# EAGLE design 7seg (EAGLE 6.4)
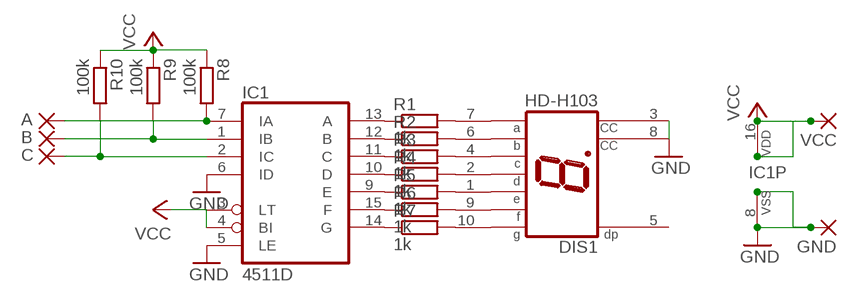
[diagram p0: schematic, sheet 1]

## Parts
A  1,6/0,9  [1,6/0,9]
B  1,6/0,9  [1,6/0,9]
C  1,6/0,9  [1,6/0,9]
DIS1  HD-H103  [HDSP-M]
GND  1,6/0,9  [1,6/0,9]
IC1  4511D  [SO16]
R1  1k  R-EU_R0805  [R0805]
R2  1k  R-EU_R0805  [R0805]
R3  1k  R-EU_R0805  [R0805]
R4  1k  R-EU_R0805  [R0805]
R5  1k  R-EU_R0805  [R0805]
R6  1k  R-EU_R0805  [R0805]
R7  1k  R-EU_R0805  [R0805]
R8  100k  R-EU_R0805  [R0805]
R9  100k  R-EU_R0805  [R0805]
R10  100k  R-EU_R0805  [R0805]
VCC  1,6/0,9  [1,6/0,9]

## Nets
GND: DIS1.3(CC) DIS1.8(CC) IC1.5(LE) IC1.6(ID) IC1.8(VSS)
N$1: IC1.13(A) R1.1
N$2: DIS1.7(A) R1.2
N$3: IC1.12(B) R2.1
N$4: DIS1.6(B) R2.2
N$5: IC1.11(C) R3.1
N$6: DIS1.4(C) R3.2
N$7: IC1.10(D) R4.1
N$8: DIS1.2(D) R4.2
N$9: IC1.9(E) R5.1
N$10: DIS1.1(E) R5.2
N$11: IC1.15(F) R6.1
N$12: DIS1.9(F) R6.2
N$13: IC1.14(G) R7.1
N$14: DIS1.10(G) R7.2
N$15: A.1(P) IC1.7(IA) R8.2
N$16: B.1(P) IC1.1(IB) R9.2
N$17: C.1(P) IC1.2(IC) R10.2
N$18: GND.1(P)
N$19: VCC.1(P)
VCC: IC1.3(LT) IC1.4(BI) IC1.16(VDD) R8.1 R9.1 R10.1
Unconnected: DIS1.5(DP)

## Library data of the parts
A B C GND VCC = wirepad:1,6/0,9: THROUGH-HOLE PAD
DIS1 = display-hp:HD-H103: LED DISPLAY 1-character 7 segment, decimal point right; OC_FARNELL: unknown; OC_NEWARK: unknown
IC1 = 45xx:4511: BCD to 7-segment LATCH/DECODER/DRIVER
R1-R10 = rcl:R-EU_: RESISTOR, European symbol

## Board
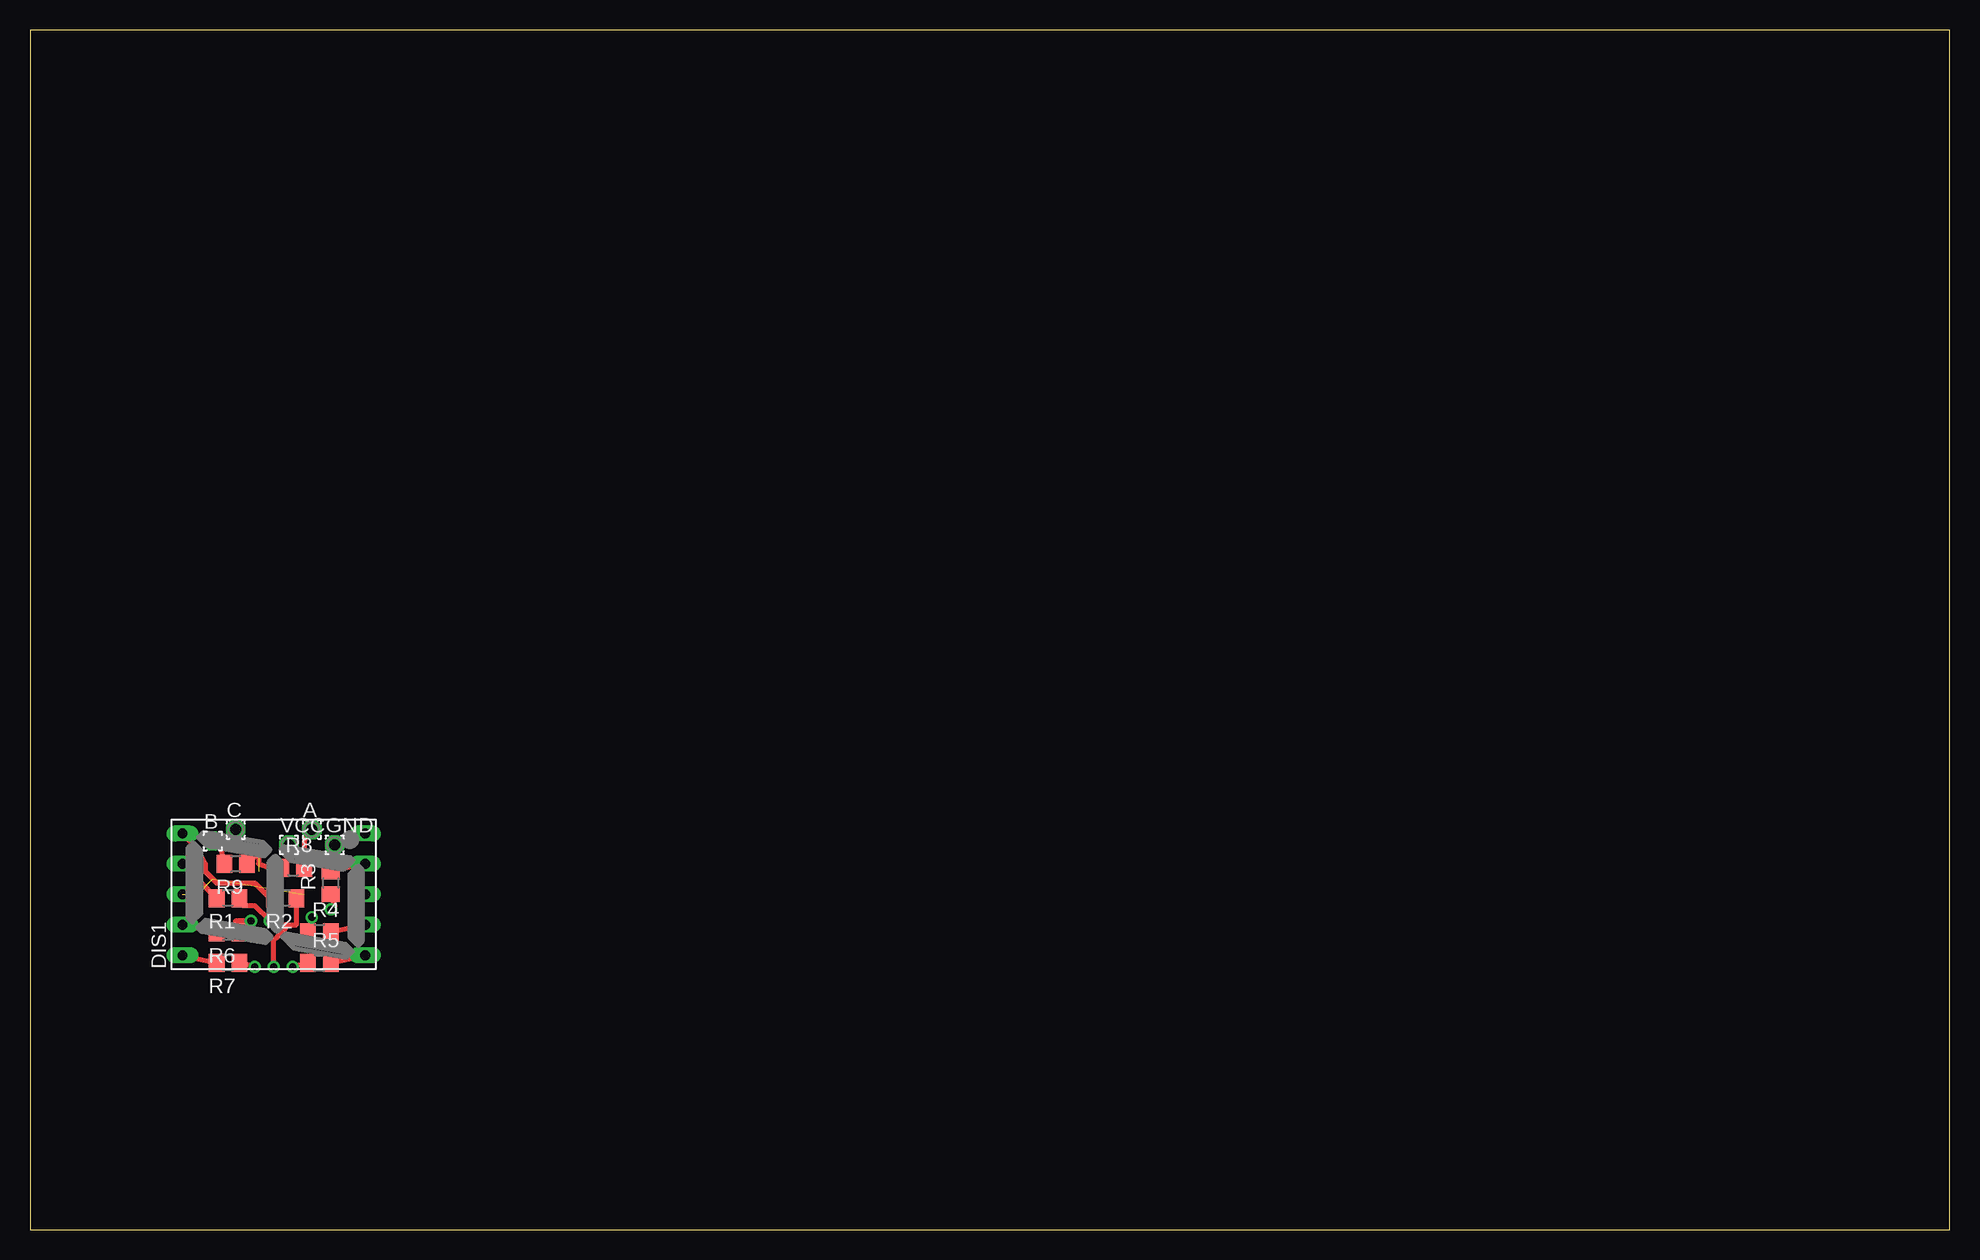
[diagram p1: board, top side]
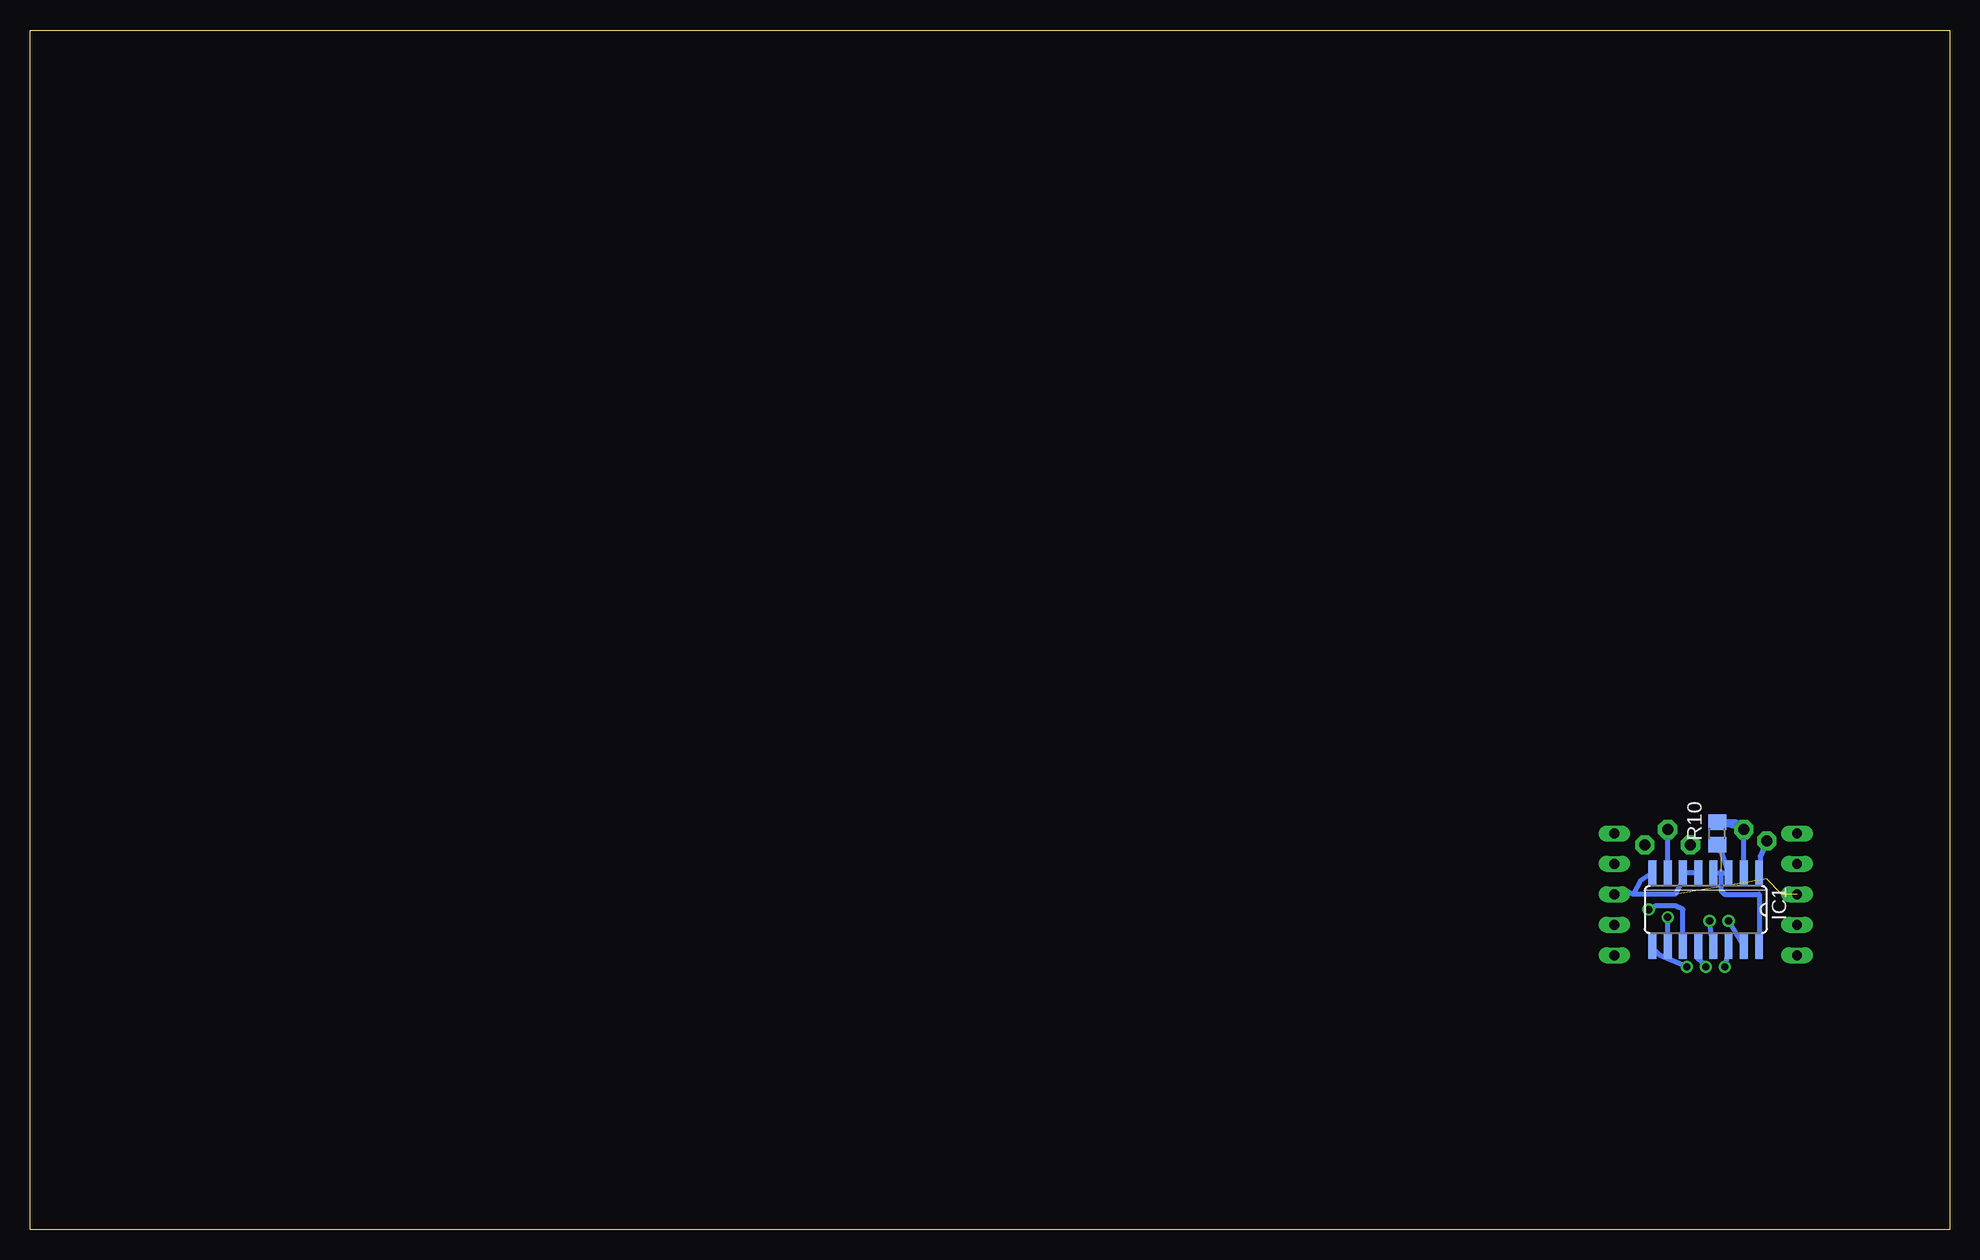
[diagram p2: board, bottom side, seen from below]

Size 160 x 100 mm. Coordinates in mm from the lower left corner, seen from the top.
Outline: 0,0 160,0 160,100 0,100 0,0
Copper layers (1*16): Top 0.035mm / dielectric 1.5mm / Bottom 0.035mm
Design rules "default": minimum track width 10mil, minimum drill 24mil, track to track 8mil, track to pad 8mil, pad to pad 8mil, via to via 8mil, smd to smd 8mil, copper to edge 40mil, drill to drill 8mil, minimum pad ring 10mil, minimum via ring 8mil, stop-mask expansion 4mil, vias tented up to drill 0mil, thermal gap 10mil

### Footprints (pad centres in the part's own frame; a part is rotated, then mirrored left to right if it is on the bottom)
1,6/0,9 = drill 0.914 pad 1.6 octagon: 1 0,0
HDSP-M = drill 0.813 long: 1 -5.08,-7.62; 2 -2.54,-7.62; 3 0,-7.62; 4 2.54,-7.62; 5 5.08,-7.62; 6 5.08,7.62; 7 2.54,7.62; 8 0,7.62; 9 -2.54,7.62; 10 -5.08,7.62
SO16 = smd 0.66 x 2.032: 1 -4.445,-3.073; 2 -3.175,-3.073; 3 -1.905,-3.073; 4 -0.635,-3.073; 5 0.635,-3.073; 6 1.905,-3.073; 7 3.175,-3.073; 8 4.445,-3.073; 9 4.445,3.073; 10 3.175,3.073; 11 1.905,3.073; 12 0.635,3.073; 13 -0.635,3.073; 14 -1.905,3.073; 15 -3.175,3.073; 16 -4.445,3.073
R0805 = smd 1.3 x 1.5: 1 -0.95,0; 2 0.95,0

### Placement (x,y rotation side)
A  23.5,33.34 0 top
B  15.24,32.38 0 top
C  17.14,33.34 0 top
DIS1  20.32,27.94 90 top
GND  25.4,32.07 0 top
IC1  20.32,26.67 180 bottom
R1  16.51,27.62 180 top
R2  21.27,27.62 180 top
R3  25.08,28.89 90 top
R4  24.13,24.77 0 top
R5  24.13,22.23 0 top
R6  16.51,24.77 180 top
R7  16.51,22.23 180 top
R8  21.91,30.16 0 top
R9  17.14,30.48 180 top
R10  19.37,33.02 90 bottom
VCC  21.59,32.07 0 top

### Tracks (layer width: path | path; a pad name or v marks a point on that pad's centre or on a via)
GND  (3 unrouted)
  Bottom 0.406: 26.35,27.94 22.86,27.94 22.23,29.11 IC1.6 IC1.5 | 26.35,27.94 26.99,28.26 DIS1.3 | IC1.8 25.72,29.11 26.35,27.94
N$1  (via drill 0.6)
  Top 0.406: v20,25.72 18.73,26.99 17.78,26.99 17.78,27.94 R1.1
  Bottom 0.406: IC1.13 v20,25.72
N$2
  Top 0.406: DIS1.7 R1.2
N$3  (via drill 0.6)
  Top 0.406: v20.32,21.91 20.32,24.13 20.64,24.45 21.27,25.08 21.27,25.4 22.23,25.4 22.22,26.36 R2.1
  Bottom 0.406: 20.95,24.13 IC1.12 20.95,22.54 v20.32,21.91
N$4
  Top 0.406: DIS1.6 13.65,32.07 13.97,31.75 14.61,30.48 14.61,29.84 15.56,28.89 18.73,28.89 20,27.62 R2.2
N$5  (via drill 0.6)
  Top 0.406: v25.08,26.67 25.4,26.98 R3.1
  Bottom 0.406: IC1.11 22.23,26.67 22.86,26.99 24.45,26.99 v25.08,26.67
N$6
  Top 0.406: DIS1.4 R3.2
N$7  (via drill 0.6)
  Top 0.406: v23.5,26.04 R4.1
  Bottom 0.406: IC1.10 v23.5,26.04
N$8
  Top 0.406: DIS1.2 R4.2
N$9  (via drill 0.6)
  Top 0.406: R5.1 v21.91,21.91
  Bottom 0.406: v21.91,21.91 24.13,22.86 24.77,23.5 IC1.9
N$10
  Top 0.406: R5.2 DIS1.1
N$11  (via drill 0.6)
  Top 0.406: v18.41,25.72 17.14,25.71 R6.1
  Bottom 0.406: IC1.15 v18.41,25.72
N$12
  Top 0.406: DIS1.9 R6.2
N$13  (via drill 0.6)
  Top 0.406: v18.73,21.91 R7.1
  Bottom 0.406: IC1.14 v18.73,21.91
N$14
  Top 0.406: DIS1.10 R7.2
N$15
  Top 0.406: A.1 22.86,32.38 R8.2
  Bottom 0.406: IC1.7 A.1
N$16
  Top 0.406: R9.2 15.88,32.07 B.1
  Bottom 0.406: B.1 15.77,31.11 IC1.1
N$17
  Bottom 0.406: IC1.2 C.1 R10.2 17.78,33.97 C.1
VCC  (3 unrouted)
  Top 0.406: R8.1 20,30.16 19.05,30.48 19.05,31.43 R9.1
  Bottom 0.406: IC1.4 IC1.3 19.05,31.65 | 19.05,31.65 19.05,31.43 | 19.05,29.84 19.05,28.26 18.73,27.94 15.88,27.94 IC1.16 | R10.1 19.05,31.65